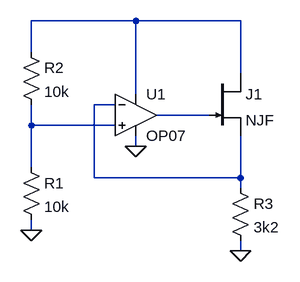
[diagram p0: schematic Draft1.asc]
Draft1.asc, the LTspice schematic file:
Version 4.1
SHEET 1 880 680
WIRE 208 -16 48 -16
WIRE 368 -16 208 -16
WIRE 48 32 48 -16
WIRE 368 64 368 -16
WIRE 208 96 208 -16
WIRE 176 112 144 112
WIRE 320 128 240 128
WIRE 48 144 48 112
WIRE 176 144 48 144
WIRE 208 176 208 160
WIRE 48 208 48 144
WIRE 144 224 144 112
WIRE 368 224 368 160
WIRE 368 224 144 224
WIRE 368 240 368 224
WIRE 48 304 48 288
WIRE 368 336 368 320
FLAG 208 176 0
FLAG 48 304 0
FLAG 368 336 0
SYMBOL OpAmps\\OP07 208 64 R0
SYMATTR InstName U1
SYMBOL res 32 192 R0
SYMATTR InstName R1
SYMATTR Value 10k
SYMBOL res 32 16 R0
SYMATTR InstName R2
SYMATTR Value 10k
SYMBOL njf 320 64 R0
SYMATTR InstName J1
SYMBOL res 352 224 R0
SYMATTR InstName R3
SYMATTR Value 3k2

The netlist it stands for:
* Draft1.asc
X§U1 N004 N002 N001 0 N003 LT1001  ; OP07, pins In+ In- V+ V- OUT
R1 N004 0 10k
R2 N001 N004 10k
J1 N001 N003 N002 NJF
R3 N002 0 3k2
.model NJF NJF
.model PJF PJF
.lib standard.jft
.lib LTC.lib
.backanno
.end